# EAGLE design PMB (EAGLE 8.1.0)
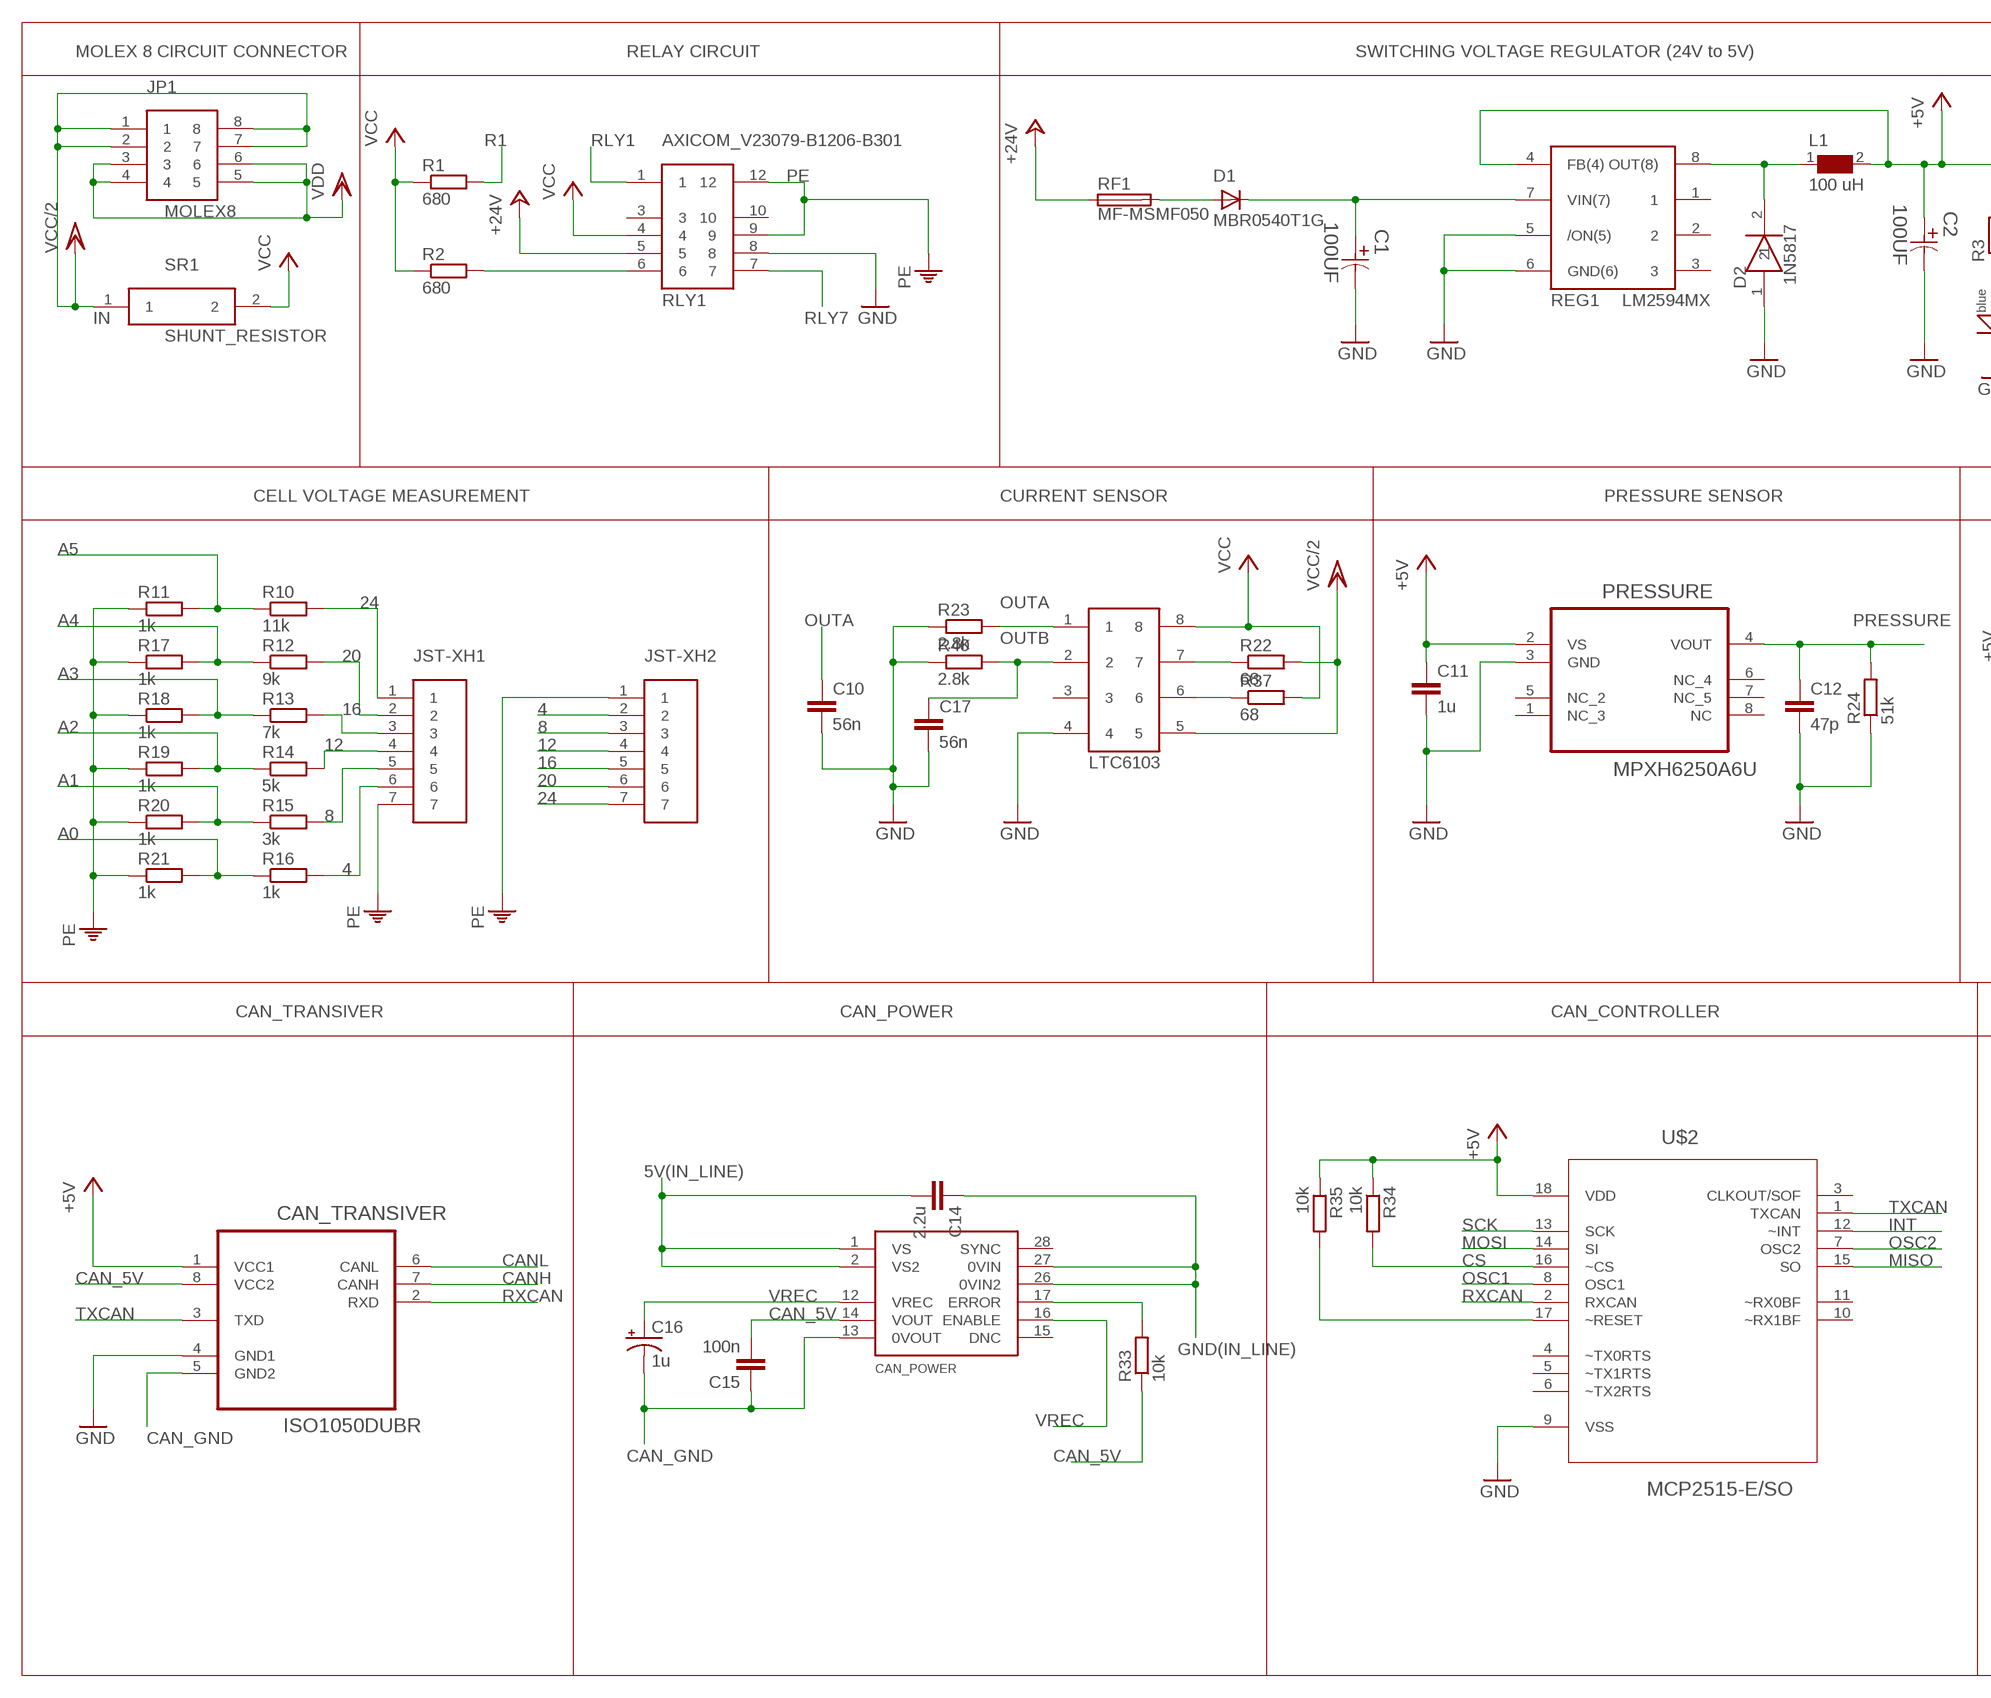
[diagram p0: schematic, sheet 1, part 1 of 2]
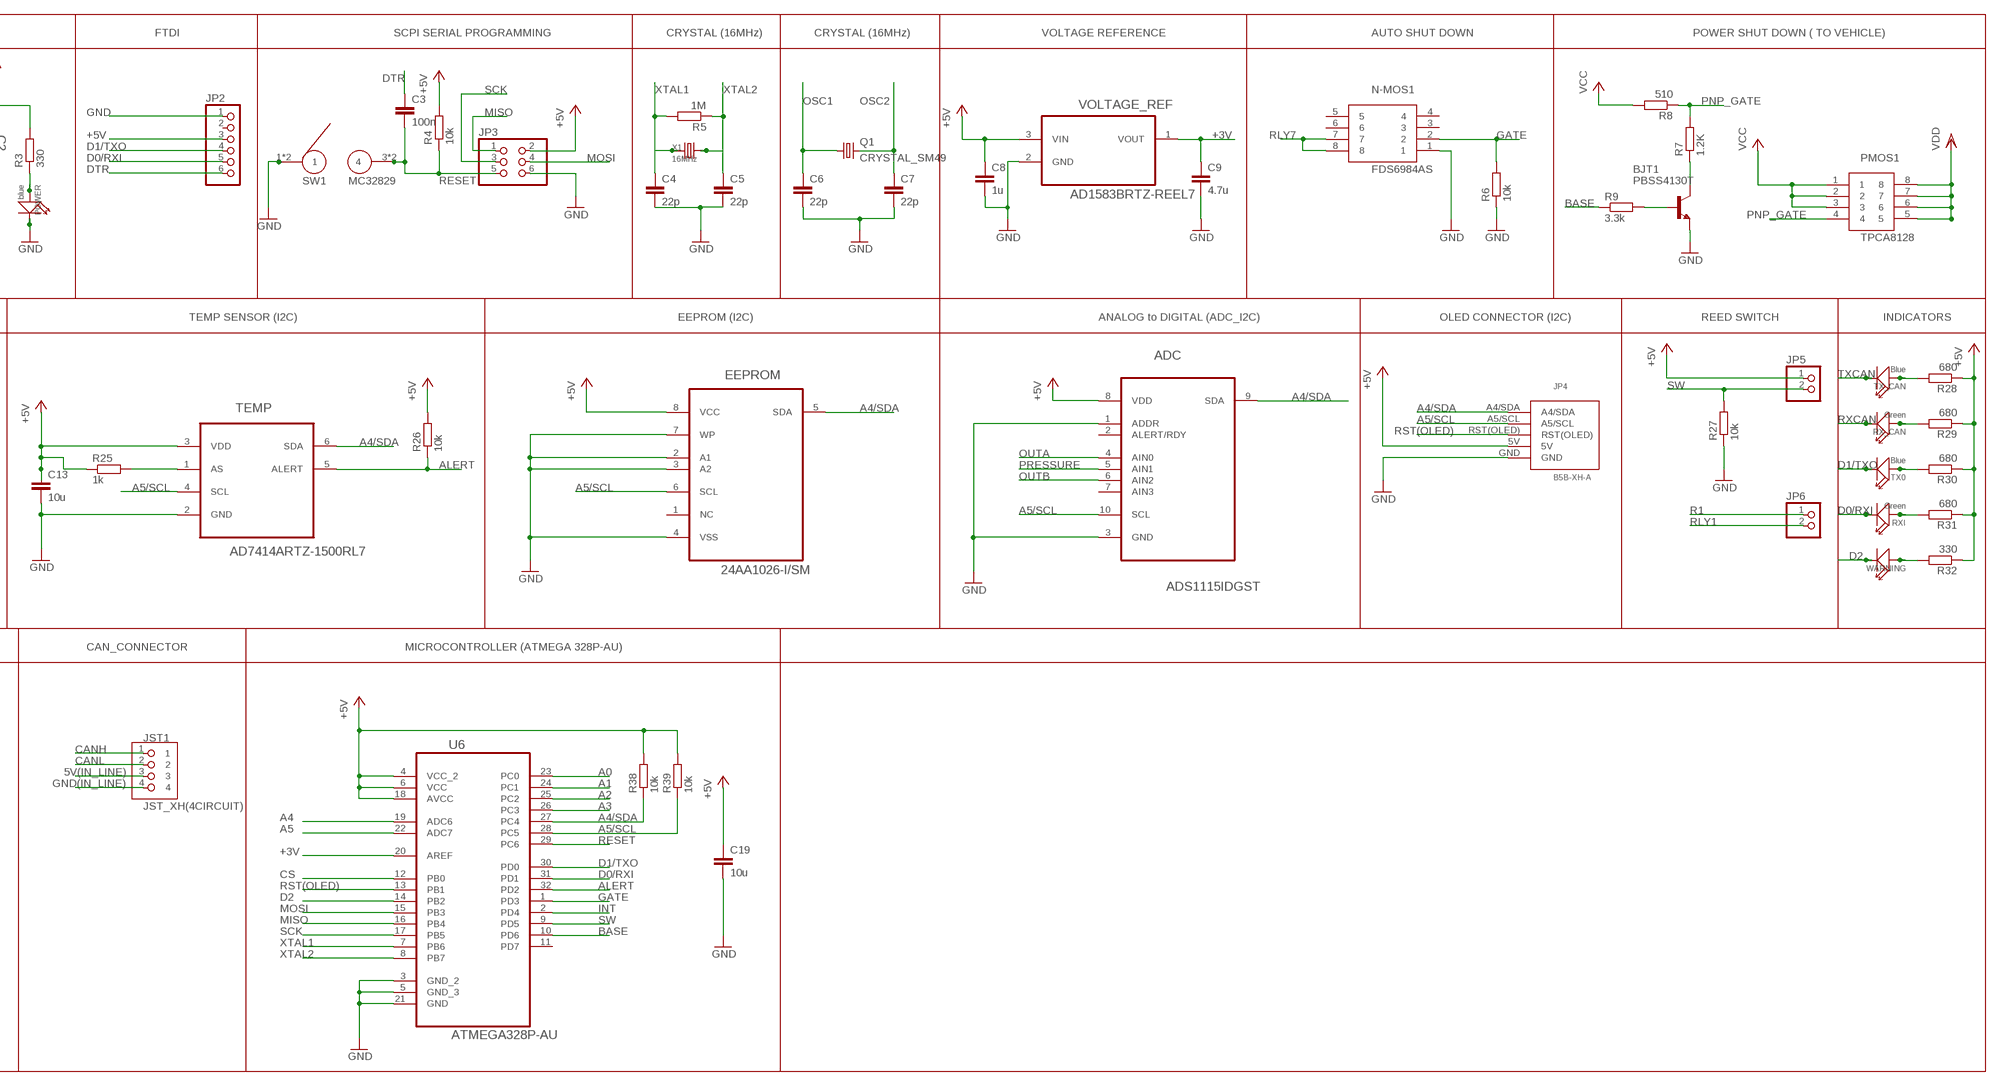
[diagram p1: schematic, sheet 1, part 2 of 2]

## Parts
ADC  ADS1115IDGST  [SOP50P490X110-10N]
BJT1  PBSS4130T  [SOT-23]
C1  100UF  EEE-FTV151XAP-CASE-D8  [CAPAE660X800N]
C2  100UF  EEE-FTV151XAP-CASE-D8  [CAPAE660X800N]
C3  100n  CAP0805  [0805]
C4  22p  CAP0805  [0805]
C5  22p  CAP0805  [0805]
C6  22p  CAP0805  [0805]
C7  22p  CAP0805  [0805]
C8  1u  CAP0805  [0805]
C9  4.7u  CAP0805  [0805]
C10  56n  CAP0805  [0805]
C11  1u  CAP0805  [0805]
C12  47p  CAP0805  [0805]
C13  10u  CAP0805  [0805]
C14  2.2u  CAP0603-CAP  [0603-CAP]
C15  100n  1UF-25V-10%(0805)  [0805]
C16  1u  CAP_POL6032  [EIA6032]
C17  56n  CAP0805  [0805]
C19  10u  CAP0805  [0805]
CAN_POWER  DCR01SO  [DCR01-SOIC28]
CAN_TRANSIVER  ISO1050DUBR  [SOIC254P1040X485-8N]
D1  MBR0540T1G  [MBR0540T1G]
D2  1N5817  [1N5817]
EEPROM  24AA1026-I/SM  [SOIC127P794X200-8N]
JP1  MOLEX8  [026013144]
JP2  PINHD-1X6/90  [1X06/90]
JP3  PINHD-2X3  [2X03]
JP4  B5B-XH-A  [B5B-XH-A]
JP5  PINHD-1X2/90  [1X02/90]
JP6  PINHD-1X2/90  [1X02/90]
JST1  JST_XH(4CIRCUIT)  [JXT-XHP-4]
JST-XH1  JST_XH_1X7_2.5MM  [SIL_1X8_2.5MM]
JST-XH2  JST_XH_1X7_2.5MM  [SIL_1X8_2.5MM]
L1  100 uH  WE-PD-7447714101_1030/1050  [WE-PD_1030/1050]
LTC1  LTC6103  [LTC6103]
N-MOS1  FDS6984AS  [SO-8]
PMOS1  TPCA8128  [TPCA8128]
POWER  blue  LED-0805  [LED-0805]
PRESSURE  MPXH6250A6U  [FREESCALE_CASE_1317]
Q1  CRYSTAL_SM49  [SM49]
R1  680  R-EU_R0805W  [R0805W]
R2  680  R-EU_R0805W  [R0805W]
R3  330  R-EU_R0805W  [R0805W]
R4  10k  R-EU_R0805W  [R0805W]
R5  1M  R-EU_R0805W  [R0805W]
R6  10k  R-EU_R0805W  [R0805W]
R7  1.2K  R-EU_R0805W  [R0805W]
R8  510  R-EU_R0805W  [R0805W]
R9  3.3k  R-EU_R0805W  [R0805W]
R10  11k  R-EU_R0805W  [R0805W]
R11  1k  R-EU_R0805W  [R0805W]
R12  9k  R-EU_R0805W  [R0805W]
R13  7k  R-EU_R0805W  [R0805W]
R14  5k  R-EU_R0805W  [R0805W]
R15  3k  R-EU_R0805W  [R0805W]
R16  1k  R-EU_R0805W  [R0805W]
R17  1k  R-EU_R0805W  [R0805W]
R18  1k  R-EU_R0805W  [R0805W]
R19  1k  R-EU_R0805W  [R0805W]
R20  1k  R-EU_R0805W  [R0805W]
R21  1k  R-EU_R0805W  [R0805W]
R22  68  R-EU_R0805W  [R0805W]
R23  2.8k  R-EU_R0805W  [R0805W]
R24  51k  R-EU_R0805W  [R0805W]
R25  1k  R-EU_R0805W  [R0805W]
R26  10k  R-EU_R0805W  [R0805W]
R27  10k  R-EU_R0805W  [R0805W]
R28  680  R-EU_R0805W  [R0805W]
R29  680  R-EU_R0805W  [R0805W]
R30  680  R-EU_R0805W  [R0805W]
R31  680  R-EU_R0805W  [R0805W]
R32  330  R-EU_R0805W  [R0805W]
R33  10k  R-EU_R0805W  [R0805W]
R34  10k  R-EU_R0805W  [R0805W]
R35  10k  R-EU_R0805W  [R0805W]
R37  68  R-EU_R0805W  [R0805W]
R38  10k  R-EU_R0805W  [R0805W]
R39  10k  R-EU_R0805W  [R0805W]
R40  2.8k  R-EU_R0805W  [R0805W]
REG1  LM2594MX  [LM2594MX]
RF1  MF-MSMF050  [MF-MSF050]
RLY1  AXICOM_V23079-B1206-B301  [RELAY_V23079_B1206]
RX_CAN  Green  LED-0805  [LED-0805]
RXI  Green  LED-0805  [LED-0805]
SR1  SHUNT_RESISTOR  [OARSXPR002FLF]
SW1  MC32829  [MC32829]
TEMP  AD7414ARTZ-1500RL7  [SOT95P280X145-6N]
TX0  Blue  LED-0805  [LED-0805]
TX_CAN  Blue  LED-0805  [LED-0805]
U6  ATMEGA328P-AU  [QFP80P900X900X120-32N]
U$2  MCP2515-E/SO  [SOIC127P1030X265-18N]
VOLTAGE_REF  AD1583BRTZ-REEL7  [SOT95P237X112-3N]
WARNING  LED-0805  [LED-0805]
X1  16MHz  CRYSTAL  [HC49US]

## Nets
4: JST-XH1.6 JST-XH2.2 R16.2
5V(IN_LINE): C14.2 CAN_POWER.1(VS) CAN_POWER.2(VS2) JST1.3
8: JST-XH1.5 JST-XH2.3 R15.2
12: JST-XH1.4 JST-XH2.4 R14.2
16: JST-XH1.3 JST-XH2.5 R13.2
20: JST-XH1.2 JST-XH2.6 R12.2
24: JST-XH1.1 JST-XH2.7 R10.2
+3V: C9.1 U6.20(AREF) VOLTAGE_REF.1(VOUT)
+5V: ADC.8(VDD) C2.1 C8.1 C11.1 C13.1 C19.1 CAN_TRANSIVER.1(VCC1) EEPROM.8(VCC) JP2.3 JP3.2 JP4.5V JP5.1 L1.2 PRESSURE.2(VS) R3.2 R4.2 R25.1 R26.2 R28.1 R29.1 R30.1 R31.1 R32.1 R34.1 R35.1 R38.2 R39.2 REG1.4(FB(4)) TEMP.3(VDD) U6.4(VCC_2) U6.6(VCC) U6.18(AVCC) U$2.18(VDD) VOLTAGE_REF.3(VIN)
+24V: RF1.1 RLY1.5
A0: R16.1 R21.2 U6.23(PC0)
A1: R15.1 R20.2 U6.24(PC1)
A2: R14.1 R19.2 U6.25(PC2)
A3: R13.1 R18.2 U6.26(PC3)
A4: R12.1 R17.2 U6.19(ADC6)
A4/SDA: ADC.9(SDA) EEPROM.5(SDA) JP4.A4/SDA R38.1 TEMP.6(SDA) U6.27(PC4)
A5: R10.1 R11.2 U6.22(ADC7)
A5/SCL: ADC.10(SCL) EEPROM.6(SCL) JP4.A5/SCL R39.1 TEMP.4(SCL) U6.28(PC5)
ALERT: R26.1 TEMP.5(ALERT) U6.32(PD2)
BASE: R9.1 U6.10(PD6)
CAN_5V: C15.2 CAN_POWER.14(VOUT) CAN_TRANSIVER.8(VCC2) R33.1
CAN_GND: C15.1 C16.P$2(-) CAN_POWER.13(0VOUT) CAN_TRANSIVER.5(GND2)
CANH: CAN_TRANSIVER.7(CANH) JST1.1
CANL: CAN_TRANSIVER.6(CANL) JST1.2
CS: R34.2 U6.12(PB0) U$2.16(~CS)
D0/RXI: JP2.5 RXI.- U6.31(PD1)
D1/TXO: JP2.4 TX0.- U6.30(PD0)
D2: U6.14(PB2) WARNING.-
DTR: C3.1 JP2.6
GATE: N-MOS1.2 R6.2 U6.1(PD3)
GND: ADC.1(ADDR) ADC.3(GND) BJT1.E C1.2 C2.2 C4.2 C5.2 C6.2 C7.2 C8.2 C9.2 C10.2 C11.2 C12.2 C13.2 C17.2 C19.2 CAN_TRANSIVER.4(GND1) D2.1 EEPROM.2(A1) EEPROM.3(A2) EEPROM.4(VSS) EEPROM.7(WP) JP2.1 JP3.6 JP4.GND LTC1.4 N-MOS1.1 POWER.- PRESSURE.3(GND) R6.1 R23.1 R24.1 R27.1 R40.1 REG1.5(/ON(5)) REG1.6(GND(6)) RLY1.8 SW1.1 SW1.2 TEMP.2(GND) U6.3(GND_2) U6.5(GND_3) U6.21(GND) U$2.9(VSS) VOLTAGE_REF.2(GND)
GND(IN_LINE): C14.1 CAN_POWER.26(0VIN2) CAN_POWER.27(0VIN) JST1.4
INT: U6.2(PD4) U$2.12(~INT)
MISO: JP3.1 U6.16(PB4) U$2.15(SO)
MOSI: JP3.4 U6.15(PB3) U$2.14(SI)
N$1: BJT1.B R9.2
N$2: D1.2 RF1.2
N$3: C1.1 D1.1 REG1.7(VIN(7))
N$4: R2.2 RLY1.6
N$5: D2.2 L1.1 REG1.8(OUT(8))
N$6: BJT1.C R7.1
N$7: POWER.+ R3.1
N$8: LTC1.7 R22.1
N$9: R25.2 TEMP.1(AS)
N$10: R32.2 WARNING.+
N$11: R31.2 RXI.+
N$12: R30.2 TX0.+
N$13: R29.2 RX_CAN.+
N$14: R28.2 TX_CAN.+
N$15: LTC1.6 R37.1
N$21: CAN_POWER.17(ERROR) R33.2
N$24: R35.2 U$2.17(~RESET)
OSC1: C6.1 Q1.1 U$2.8(OSC1)
OSC2: C7.1 Q1.2 U$2.7(OSC2)
OUTA: ADC.4(AIN0) C10.1 LTC1.1 R23.2
OUTB: ADC.6(AIN2) C17.1 LTC1.2 R40.2
PE: JST-XH1.7 JST-XH2.1 R11.1 R17.1 R18.1 R19.1 R20.1 R21.1 RLY1.9 RLY1.12
PNP_GATE: PMOS1.4 R7.2 R8.1
PRESSURE: ADC.5(AIN1) C12.1 PRESSURE.4(VOUT) R24.2
R1: JP6.1 R1.2
RESET: C3.2 JP3.5 R4.1 SW1.3 SW1.4 U6.29(PC6)
RLY1: JP6.2 RLY1.1
RLY7: N-MOS1.7 N-MOS1.8 RLY1.7
RST(OLED): JP4.RST(OLED) U6.13(PB1)
RXCAN: CAN_TRANSIVER.2(RXD) RX_CAN.- U$2.2(RXCAN)
SCK: JP3.3 U6.17(PB5) U$2.13(SCK)
SW: JP5.2 R27.2 U6.9(PD5)
TXCAN: CAN_TRANSIVER.3(TXD) TX_CAN.- U$2.1(TXCAN)
VCC: LTC1.8 PMOS1.1 PMOS1.2 PMOS1.3 R1.1 R2.1 R8.2 R37.2 RLY1.4 SR1.2
VCC/2: JP1.1 JP1.2 JP1.7 JP1.8 LTC1.5 R22.2 SR1.1
VDD: JP1.3 JP1.4 JP1.5 JP1.6 PMOS1.5 PMOS1.6 PMOS1.7 PMOS1.8
VREC: C16.P$1(+) CAN_POWER.12(VREC) CAN_POWER.16(ENABLE)
XTAL1: C4.1 R5.2 U6.7(PB6) X1.1
XTAL2: C5.1 R5.1 U6.8(PB7) X1.2
Unconnected: ADC.2(ALERT/RDY) ADC.7(AIN3) CAN_POWER.15(DNC) CAN_POWER.28(SYNC) EEPROM.1(NC) JP2.2 LTC1.3 N-MOS1.3 N-MOS1.4 N-MOS1.5 N-MOS1.6 PRESSURE.1(NC_3) PRESSURE.5(NC_2) PRESSURE.6(NC_4) PRESSURE.7(NC_5) PRESSURE.8(NC) REG1.1 REG1.2 REG1.3 RLY1.3 RLY1.10 U6.11(PD7) U$2.3(CLKOUT/SOF) U$2.4(~TX0RTS) U$2.5(~TX1RTS) U$2.6(~TX2RTS) U$2.10(~RX1BF) U$2.11(~RX0BF)

## Notes on the sheet
- MOLEX 8 CIRCUIT CONNECTOR | RELAY CIRCUIT | SWITCHING VOLTAGE REGULATOR (24V to 5V) | FTDI | SCPI SERIAL PROGRAMMING | CRYSTAL (16MHz) | CRYSTAL (16MHz) | VOLTAGE REFERENCE | AUTO SHUT DOWN | POWER SHUT DOWN ( TO VEHICLE)
- IN
- CELL VOLTAGE MEASUREMENT | CURRENT SENSOR | PRESSURE SENSOR | TEMP SENSOR (I2C) | EEPROM (I2C) | ANALOG to DIGITAL (ADC_I2C) | OLED CONNECTOR (I2C) | REED SWITCH | INDICATORS
- CAN_TRANSIVER | CAN_POWER | CAN_CONTROLLER | CAN_CONNECTOR | MICROCONTROLLER (ATMEGA 328P-AU)

## Library data of the parts
ADC = ADS1115:ADS1115IDGST: Analog-to-Digital Converter with Internal Reference; MPN: ADS1115IDGST; OC_FARNELL: 1762981; OC_NEWARK: 25R1241; PACKAGE: MSOP-10; SUPPLIER: Texas Instruments
BJT1 = NPN:PBSS4130T
C1 C2 = Panasonic-EEEFT_EEEH:EEE-: Aluminum Electrolytic Capacitors,Surface Mount Type; MPN: EEE-FTV151XAP; OC_FARNELL: 1868418; OC_NEWARK: 31T8173; PACKAGE: CASE-D8; SUPPLIER: PANASONIC; TOLERANCE: ±20 %; VALUE: 150UF; VOLTAGERATING: 35V
C3-C13 C17 C19 = SparkFun-Capacitors:CAP: Capacitor Standard 0603 ceramic capacitor, and 0.1" leaded capacitor.
C14 = SparkFun-Passives:CAP: Capacitor Standard 0603 ceramic capacitor, and 0.1" leaded capacitor.
C15 = SparkFun-Capacitors:1UF-25V-10%(0805): CAP-08064; PROD_ID: CAP-08064; VALUE: 1uF
C16 = SparkFun-Passives:CAP_POL: Capacitor Polarized These are standard SMD and PTH capacitors. Normally 10uF, 47uF, and 100uF in electrolytic and tantalum varieties. Always verify the external diameter of the through hole cap, it varies with capacity, voltage, and manufacturer. The EIA devices should be standard.
CAN_POWER = bbauv:DCR01: The DCR01 family is a series of high-efficiency, input-isolated, output-regulated DC/DC converters. In addition to 1W nominal, galvanically-isolated output power capability, this range of DC/DCs offer very low output noise, thermal protection, and high accuracy. The DCR01 family is implemented in standard molded IC packaging, giving standard JEDEC outlines suitable for high-volume assembly. The DCR01 is manufactured using the same technology as standard IC packages, thereby achieving very high reliability.
CAN_TRANSIVER = CAN-Controller-Library:ISO1050DUBR: ISOLATED CAN TRANSCEIVER; MPN: ISO1050DUBR; OC_FARNELL: 2118645; OC_NEWARK: 14R9899; PACKAGE: DIP-8; SUPPLIER: TEXAS INSTRUMENTS
D1 = Power_diode:MBR0540T1G
D2 = diode:1N5817
EEPROM = eeprom:24AA1026-I/SM: Serial EEPROM,SOIC-8; MPN: 24AA1026-I/SM; OC_FARNELL: 1971893; OC_NEWARK: 59T0229; PACKAGE: SOIC-8; SUPPLIER: MICROCHIP
JP1 = molex8:MOLEX8
JP2 = pinhead:PINHD-1X6: PIN HEADER
JP3 = pinhead:PINHD-2X3: PIN HEADER
JP4 = jst-xh(5circuit):B5B-XH-A
JP5 JP6 = pinhead:PINHD-1X2: PIN HEADER
JST1 = jst-xh(4circuit):JST_XH(4CIRCUIT)
JST-XH1 JST-XH2 = SIL_1X8_2.5MM:JST_XH_1X7_2.5MM
L1 = WE-PD:WE-PD: SMD-Shielded Power Inductors WE-PD - Magnetically shielded version which results in a low leakage field - High storage capacity - Low self-losses - Highest possible current loading for SMD-Inducors -- Switching regulators with low operating voltages (computer, laptop, mobile phones, pagers) -- Integrated DC/DC-converter -- Is recommended for the application with switching regulators from National Semiconductor, Linear Technology, Texas Instruments and Fairchild Semiconductor, ect. -- Graphic cards -- Plastic base: Because of the one piece construction these are more suitable for high vibration or shock applications; MPN: 7447714101; OC_FARNELL: 2082677; OC_NEWARK: 88T7105; PACKAGE: 1050; SUPPLIER: Wuerth Elektronik
LTC1 = LTC6103:LTC6103
N-MOS1 = dual_n-mosfet:FDS6984AS
PMOS1 = p-mosfet:TPCA8128
POWER RX_CAN RXI TX0 TX_CAN WARNING = Discrete:LED
PRESSURE = pressure_sensor:MPXH6250A6U: SENSOR, PRESSURE, 20-250KPA, CASE 1317; MPN: MPXH6250A6U; OC_FARNELL: 2238140; OC_NEWARK: 47W3656; PACKAGE: CASE 1317; SUPPLIER: FREESCALE SEMICONDUCTOR
Q1 = crystal(16Mhz):CRYSTAL_SM49
R1-R35 R37-R40 = resistor:R-EU_: RESISTOR, European symbol
REG1 = lm2594:LM2594MX
RF1 = Resetable_fuse:MF-MSMF050
RLY1 = AXICOM_V23079_B1206:AXICOM_V23079-B1206-B301
SR1 = oarsxpr002flf:SHUNT_RESISTOR
SW1 = mc32829(pb_sw):MC32829
TEMP = pressure_sensor(AD7414):AD7414ARTZ-1500RL7: ±0.5°C Accurate, 10-Bit Digital Temperature Sensors; MPN: AD7414ARTZ-1500RL7; OC_FARNELL: 1699530; OC_NEWARK: 12M8805; PACKAGE: SOT-23-6; SUPPLIER: Analog Devices
U6 = atmel-atmega328p-au:ATMEGA328P-AU: 8-bit Microcontroller with In-System Programmable Flash; MPN: ATMEGA328P-AU; OC_FARNELL: 1715486; OC_NEWARK: 14R4631; PACKAGE: TQFP-32; SUPPLIER: Atmel
U$2 = CAN-Controller-Library:MCP2515-E/SO: Stand-Alone CAN Controller; DESCRIPTION: IC CAN CONTROLLER; MPN: MCP2515-E/SO; OC_FARNELL: 1605565; OC_NEWARK: 29H7134; PACKAGE: SOIC-18; SUPPLIER: Microchip
VOLTAGE_REF = AD1583:AD1583BRTZ-REEL7: Series Mode Voltage References; MPN: AD1583BRTZ-Reel7; OC_FARNELL: 2074900; OC_NEWARK: 59K3394; PACKAGE: SOT23-3; SUPPLIER: Analog Devices
X1 = Discrete:CRYSTAL*

## Board
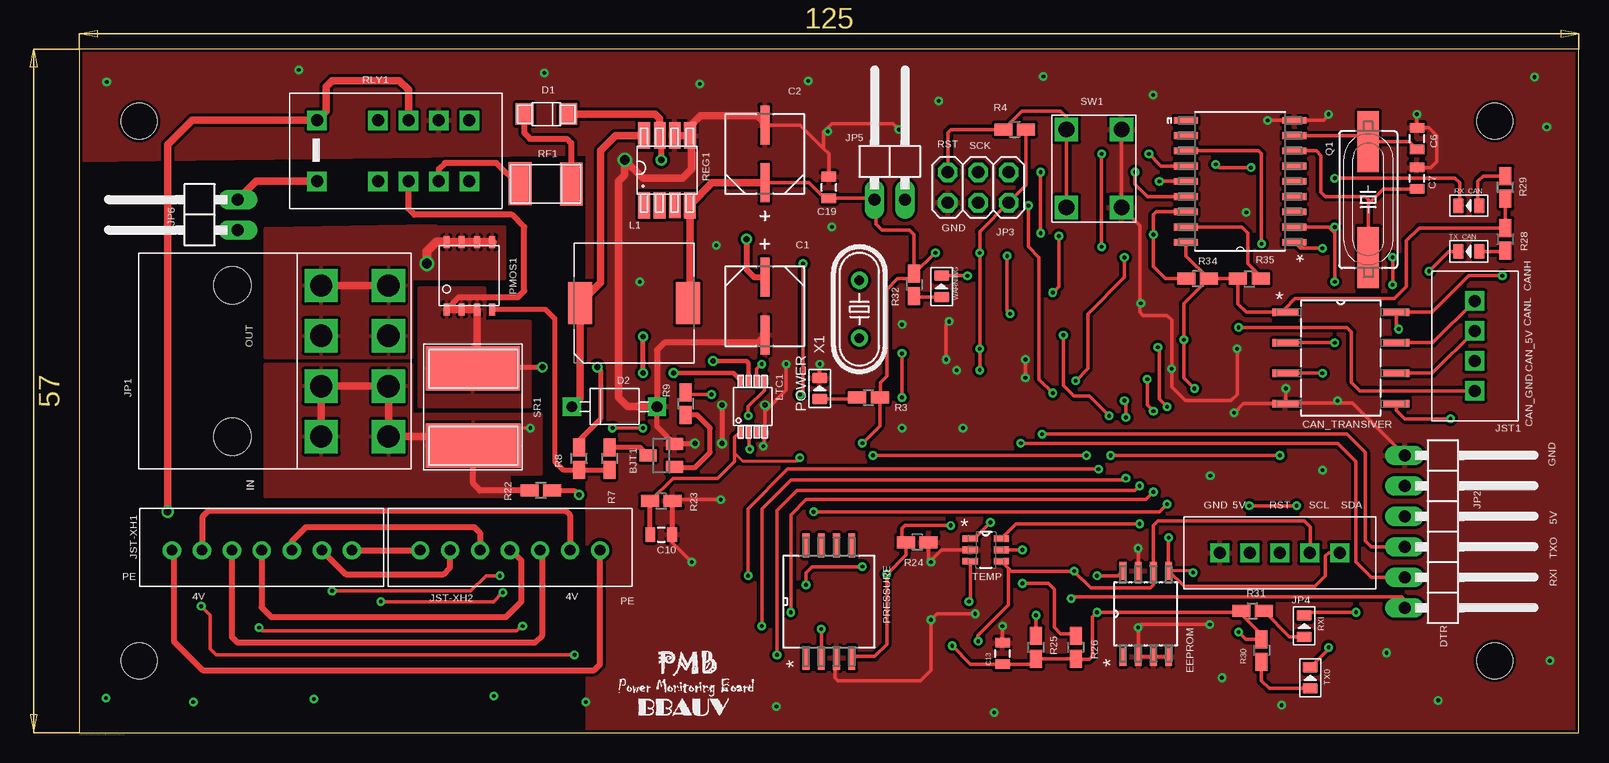
[diagram p2: board, top side]
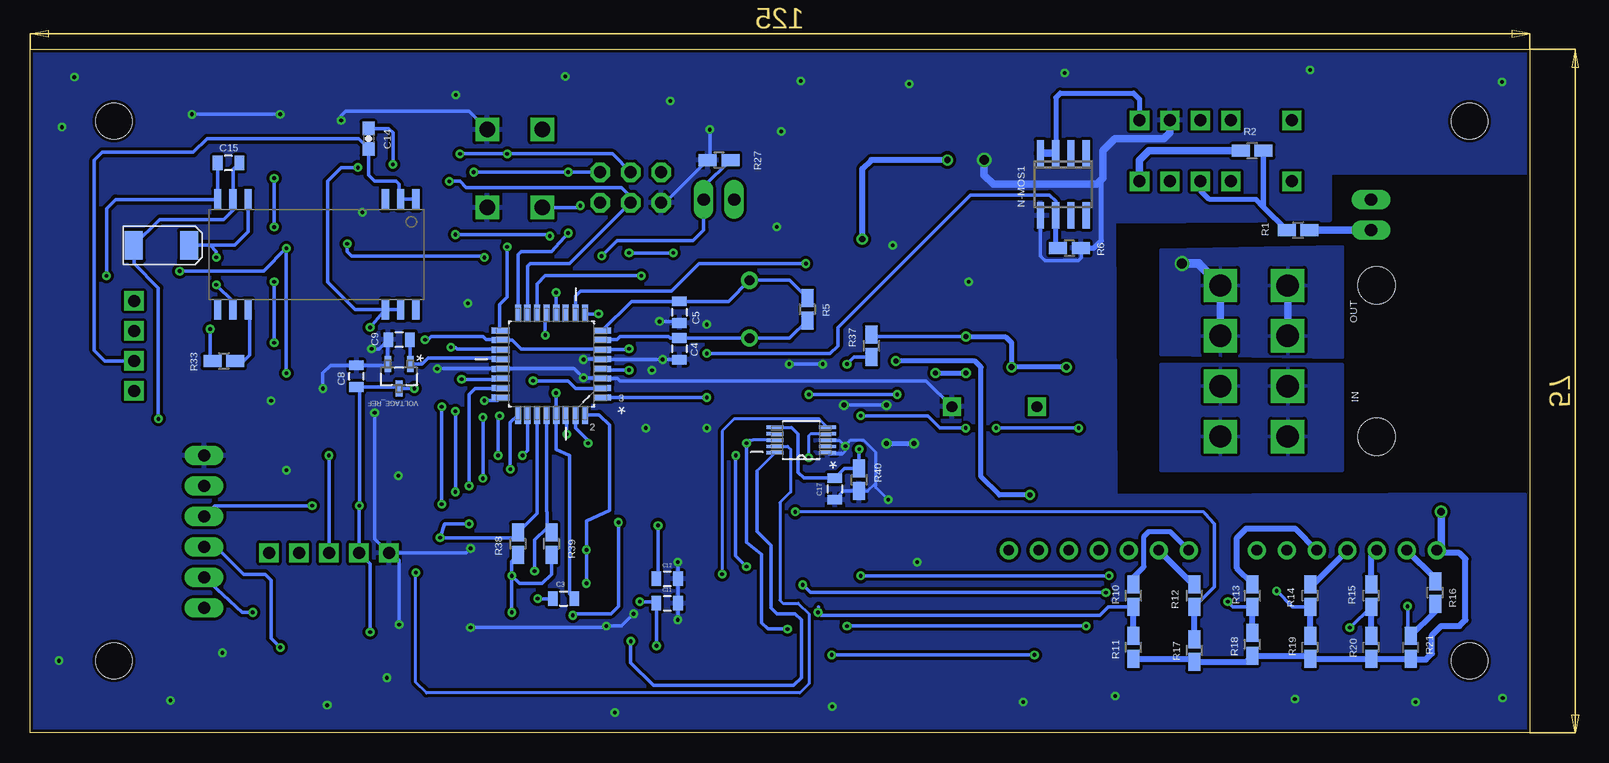
[diagram p3: board, bottom side, seen from below]

Size 125 x 57 mm. Coordinates in mm from the lower left corner, seen from the top.
Outline: 0,0 125,0 125,57 0,57 0,0
Copper layers (1*16): Top 0.035mm / dielectric 1.5mm / Bottom 0.035mm
Design rules "3ozKentronics *": minimum track width 10mil, minimum drill 12mil, track to track 10mil, track to pad 10mil, pad to pad 10mil, via to via 10mil, smd to smd 0mil, copper to edge 10mil, drill to drill 10mil, minimum pad ring 12mil, minimum via ring 8mil, stop-mask expansion 2mil, vias tented up to drill 25mil, thermal gap 10mil
Holes 3 mm at 118,6 118,51 5,6 5,51

### Footprints (pad centres in the part's own frame; a part is rotated, then mirrored left to right if it is on the bottom)
SOP50P490X110-10N = smd 1.422 x 0.279: 1 -2.184,1.054; 2 -2.184,0.521; 3 -2.184,-0.013; 4 -2.184,-0.546; 5 -2.184,-1.079; 6 2.184,-1.079; 7 2.184,-0.546; 8 2.184,-0.013; 9 2.184,0.521; 10 2.184,1.054
SOT-23 = smd 1 x 1.4: B -0.95,-1.1; C 0,1.1; E 0.95,-1.1
CAPAE660X800N = smd 3.251 x 0.762: 1 -2.413,0; 2 2.413,0
0805 = smd 0.8 x 1.2: 1 -0.9,0; 2 0.9,0
0603-CAP = smd 1.1 x 1: 1 -0.85,0; 2 0.85,0
EIA6032 = smd 1.5 x 2.4: P$1 -2.3,0; P$2 2.3,0
DCR01-SOIC28 = smd 0.6 x 1.7: 1 -8.255,-4.6; 2 -6.985,-4.6; 3 -5.715,-4.6; 12 5.715,-4.6; 13 6.985,-4.6; 14 8.255,-4.6; 15 8.255,4.6; 16 6.985,4.6; 17 5.715,4.6; 26 -5.715,4.6; 27 -6.985,4.6; 28 -8.255,4.6; P$2 -6.985,4.6
SOIC254P1040X485-8N = smd 2.159 x 0.61: 1 -4.623,3.81; 2 -4.623,1.27; 3 -4.623,-1.27; 4 -4.623,-3.81; 5 4.623,-3.81; 6 4.623,-1.27; 7 4.623,1.27; 8 4.623,3.81
MBR0540T1G = smd 1.5 x 1.8: 1 1.87,0.03; 2 -1.74,0.02
1N5817 = drill 0.9 square: 1 -3.2,0; 2 3.9,0
SOIC127P794X200-8N = smd 1.473 x 0.559: 1 -3.581,1.905; 2 -3.581,0.635; 3 -3.581,-0.635; 4 -3.581,-1.905; 5 3.581,-1.905; 6 3.581,-0.635; 7 3.581,0.635; 8 3.581,1.905
026013144 = drill 1.85 square: 1 -6.3,-2.8; 2 -2.1,-2.8; 3 2.1,-2.8; 4 6.3,-2.8; 5 6.3,2.8; 6 2.1,2.8; 7 -2.1,2.8; 8 -6.3,2.8 | hole 3.1: -6.3,10.2; 6.3,10.2
1X06/90 = drill 1.016 long: 1 -6.35,-3.81; 2 -3.81,-3.81; 3 -1.27,-3.81; 4 1.27,-3.81; 5 3.81,-3.81; 6 6.35,-3.81
2X03 = drill 1.016 octagon: 1 -2.54,-1.27; 2 -2.54,1.27; 3 0,-1.27; 4 0,1.27; 5 2.54,-1.27; 6 2.54,1.27
B5B-XH-A = drill 1 square: 5V 2.5,0; A4/SDA -5,0; A5/SCL -2.5,0; GND 5,0; RST(OLED) 0,0
1X02/90 = drill 1.016 long: 1 -1.27,-3.81; 2 1.27,-3.81
JXT-XHP-4 = drill 1 square: 1 -3.75,0; 2 -1.25,0; 3 1.25,0; 4 3.75,0
SIL_1X8_2.5MM = drill 0.9: 1 -7.5,0; 2 -5,0; 3 -2.5,0; 4 0.02,0; 5 2.5,0; 6 5,0; 7 7.5,0
WE-PD_1030/1050 = smd 2 x 3.5: 1 -4.5,0; 2 4.5,0
LTC6103 = smd 0.406 x 1.016: 1 -0.98,-2.169; 4 0.98,-2.169 | smd 0.381 x 1.016: 2 -0.32,-2.169; 3 0.32,-2.159; 5 0.97,2.19; 6 0.33,2.18 | smd 0.394 x 1.016: 7 -0.33,2.18; 8 -0.98,2.19
SO-8 = smd 0.6 x 2.2: 1 1.905,2.6; 2 0.635,2.6; 3 -0.635,2.6; 4 -1.905,2.6; 5 -1.905,-2.6; 6 -0.635,-2.6; 7 0.635,-2.6; 8 1.905,-2.6
TPCA8128 = smd 0.5 x 1: 1 -1.905,-2.8; 2 -0.635,-2.8; 3 0.635,-2.8; 4 1.905,-2.8; 5 1.905,2.8; 6 0.635,2.8; 7 -0.635,2.8; 8 -1.905,2.8
LED-0805 = smd 0.889 x 1.27: + -0.889,0; - 0.889,0
FREESCALE_CASE_1317 = smd 1.981 x 0.559: 1 -4.699,1.905; 2 -4.699,0.635; 3 -4.699,-0.635; 4 -4.699,-1.905; 5 4.699,-1.905; 6 4.699,-0.635; 7 4.699,0.635; 8 4.699,1.905
SM49 = smd 5.08 x 1.778: 1 -4.826,0; 2 4.826,0
R0805W = smd 1.5 x 1: 1 -0.94,0; 2 0.94,0
LM2594MX = smd 1 x 2.2: 1 -1.93,-3.01; 2 -0.65,-3.01; 5 1.89,2.81; 8 -1.93,2.8 | smd 0.978 x 2.2: 3 0.62,-3; 4 1.87,-3.01 | smd 0.978 x 2.184: 6 0.61,2.819; 7 -0.635,2.819
MF-MSF050 = smd 1.9 x 3.6: 1 -2.13,0.05; 2 2.15,0.03
RELAY_V23079_B1206 = drill 1 square: 1 -7.62,-2.54; 3 -2.54,-2.54; 4 0,-2.54; 5 2.54,-2.54; 6 5.08,-2.54; 7 5.08,2.54; 8 2.54,2.54; 9 0,2.54; 10 -2.54,2.54; 12 -7.62,2.54
OARSXPR002FLF = smd 3.7 x 7.9: 1 -3.26,0.19; 2 3.19,0.22
MC32829 = drill 1.3 square: 1 -3.3,2.3; 2 3.2,2.3; 3 -3.3,-2.3; 4 3.2,-2.3
SOT95P280X145-6N = smd 1.27 x 0.559: 1 -1.295,0.94; 2 -1.295,0; 3 -1.295,-0.94; 4 1.295,-0.94; 5 1.295,0; 6 1.295,0.94
QFP80P900X900X120-32N = smd 1.473 x 0.508: 1 -4.242,2.794; 2 -4.242,2.007; 3 -4.242,1.194; 4 -4.242,0.406; 5 -4.242,-0.406; 6 -4.242,-1.194; 7 -4.242,-2.007; 8 -4.242,-2.794; 17 4.242,-2.794; 18 4.242,-2.007; 19 4.242,-1.194; 20 4.242,-0.406; 21 4.242,0.406; 22 4.242,1.194; 23 4.242,2.007; 24 4.242,2.794 | smd 0.508 x 1.473: 9 -2.794,-4.242; 10 -2.007,-4.242; 11 -1.194,-4.242; 12 -0.406,-4.242; 13 0.406,-4.242; 14 1.194,-4.242; 15 2.007,-4.242; 16 2.794,-4.242; 25 2.794,4.242; 26 2.007,4.242; 27 1.194,4.242; 28 0.406,4.242; 29 -0.406,4.242; 30 -1.194,4.242; 31 -2.007,4.242; 32 -2.794,4.242
SOIC127P1030X265-18N = smd 1.981 x 0.559: 1 -4.521,5.08; 2 -4.521,3.81; 3 -4.521,2.54; 4 -4.521,1.27; 5 -4.521,0; 6 -4.521,-1.27; 7 -4.521,-2.54; 8 -4.521,-3.81; 9 -4.521,-5.08; 10 4.521,-5.08; 11 4.521,-3.81; 12 4.521,-2.54; 13 4.521,-1.27; 14 4.521,0; 15 4.521,1.27; 16 4.521,2.54; 17 4.521,3.81; 18 4.521,5.08
SOT95P237X112-3N = smd 1.321 x 0.559: 1 -1.016,0.94; 2 -1.016,-0.94; 3 1.016,0
HC49US = drill 0.813: 1 -2.413,0; 2 2.413,0

### Placement (x,y rotation side)
ADC  60.71,24.38 180 bottom
BJT1  48.51,23.11 90 top
C1  57.15,35.56 270 top
C2  57.15,48.26 90 top
C3  80.52,11.18 0 bottom
C4  70.87,32 270 bottom
C5  70.87,35.05 270 bottom
C6  111.51,49.53 90 top
C7  111.51,46.23 90 top
C8  97.79,29.72 90 bottom
C9  94.23,32.77 180 bottom
C10  48.51,16.51 0 top
C11  71.88,10.79 0 bottom
C12  71.88,12.83 0 bottom
C13  76.96,6.6 90 top
C14  96.77,49.53 270 bottom
C15  108.46,47.5 180 bottom
C16  114.05,40.64 180 bottom
C17  57.91,20.32 270 bottom
C19  62.48,45.47 90 top
CAN_POWER  101.09,39.88 180 bottom
CAN_TRANSIVER  105.16,31.24 0 top
D1  38.86,51.56 0 top
D2  44.96,27.18 180 top
EEPROM  88.9,9.91 90 top
JP1  22.97,30.99 90 top
JP2  114.3,16.76 270 top
JP3  74.93,45.47 180 top
JP4  100.08,14.99 180 top
JP5  67.56,48.26 0 top
JP6  9.4,43.18 90 top
JST1  116.33,32.26 270 top
JST-XH1  15.22,15.21 180 top
JST-XH2  35.91,15.21 180 top
L1  46.23,35.81 0 top
LTC1  56.13,27.18 0 top
N-MOS1  38.86,45.72 180 bottom
PMOS1  32.51,38.1 0 top
POWER  61.72,28.7 90 top
PRESSURE  62.48,10.92 90 top
Q1  107.44,44.45 270 top
R1  19.3,41.91 0 bottom
R2  23.11,48.51 180 bottom
R3  65.79,27.94 0 top
R4  77.98,50.29 0 top
R5  60.2,35.31 270 bottom
R6  38.35,40.39 180 bottom
R7  44.2,22.86 270 top
R8  41.66,22.86 90 top
R9  50.55,27.43 270 top
R10  33.02,11.43 90 bottom
R11  33.02,7.11 90 bottom
R12  27.94,11.43 90 bottom
R13  23.11,11.43 90 bottom
R14  18.29,11.43 90 bottom
R15  13.21,11.43 90 bottom
R16  7.87,11.68 90 bottom
R17  27.94,6.86 90 bottom
R18  23.11,7.37 90 bottom
R19  18.29,7.11 90 bottom
R20  13.21,7.11 90 bottom
R21  9.91,7.11 90 bottom
R22  38.48,20.19 180 top
R23  48.51,19.3 180 top
R24  69.85,15.88 180 top
R25  79.76,7.11 90 top
R26  83.06,7.11 270 top
R27  67.56,47.75 0 bottom
R28  118.87,41.15 270 top
R29  118.87,45.47 90 top
R30  98.55,6.86 270 top
R31  97.79,10.16 0 top
R32  69.6,37.34 270 top
R33  108.84,30.99 0 bottom
R34  93.22,37.85 180 top
R35  97.54,37.85 0 top
R37  54.86,32.26 90 bottom
R38  84.33,15.75 270 bottom
R39  81.53,15.75 270 bottom
R40  55.88,21.08 90 bottom
REG1  49.02,46.99 0 top
RF1  38.86,45.72 0 top
RLY1  27.43,48.51 0 top
RX_CAN  115.82,43.94 180 top
RXI  102.11,8.89 90 top
SR1  33.02,27.18 90 top
SW1  84.58,46.99 270 top
TEMP  75.56,15.24 0 top
TX0  102.62,4.57 90 top
TX_CAN  115.82,40.13 180 top
U6  81.53,30.73 180 bottom
U$2  96.77,45.97 180 top
VOLTAGE_REF  94.23,29.72 270 bottom
WARNING  71.88,37.21 90 top
X1  65.02,35.31 90 top

### Tracks (layer width: path | path; a pad name or v marks a point on that pad's centre or on a via)
4
  Top 0.508: JST-XH1.6 10.29,15.28 10.29,18.03 10.79,18.54 40.51,18.54 40.91,18.14 JST-XH2.2
  Bottom 0.457: R16.2 7.87,12.86
  Bottom 0.508: 7.87,12.86 JST-XH1.6
5V(IN_LINE)
  Bottom 0.305: CAN_POWER.1 CAN_POWER.2 94.23,44.6 94.23,45.72 94.49,45.97 96.27,45.97 96.77,46.48 C14.2 97.62,49.53 110.24,49.53 111.38,48.39 119,48.39 119.63,47.75 119.63,31.88 118.77,31.01 JST1.3
8
  Top 0.508: JST-XH1.5 12.72,7.98 13.21,7.49 37.97,7.49 38.61,8.13 38.61,15.01 JST-XH2.3
  Bottom 0.508: R15.2 13.21,14.72 JST-XH1.5
12
  Top 0.508: JST-XH1.4 15.2,10.45 16,9.65 35.56,9.65 36.83,10.92 36.83,14.35 35.97,15.21 JST-XH2.4
  Bottom 0.457: R14.2 18.04,12.37
  Bottom 0.508: 18.04,12.37 JST-XH1.4
16
  Top 0.508: JST-XH1.3 17.72,15.94 18.92,17.14 32.89,17.14 33.4,16.64 JST-XH2.5
  Bottom 0.457: R13.2 23.11,12.45
  Bottom 0.508: 23.11,12.45 24.38,13.72 24.38,16.26 23.62,17.02 19.53,17.02 JST-XH1.3
20
  Top 0.508: 30.99,15.13 JST-XH2.6 30.91,13.77 30.35,13.21 22.22,13.21 JST-XH1.2
  Bottom 0.508: R12.2 28.07,12.37 JST-XH2.6
24
  Top 0.508: JST-XH1.1 JST-XH2.7
  Bottom 0.406: 33.02,12.95 32.13,13.84 32.13,16.38 31.75,16.76 29.96,16.76 JST-XH2.7
  Bottom 0.508: R10.2 33.02,12.95
+3V
  Bottom 0.305: C9.1 93.29,32.73 VOLTAGE_REF.1 92.33,30.73 91.82,31.24 85.88,31.24 U6.20
+5V  (via drill 0.32)
  Top 0.305: R32.1 69.6,41.53 69.22,41.91 66.93,41.91 66.42,42.42 66.42,44.32 JP5.1 66.18,44.57 C19.1 62.11,44.57 60.83,45.85 C2.1 | R32.1 69.16,37.85 68.2,37.85 67.31,36.96 67.31,29.72 66.8,29.21 66.8,27.94 R3.2 66.73,25.58 v65.28,24.13 65.46,24.13 | R32.1 71.32,40.01 v71.37,40.01 | R4.2 78.92,45.64 JP3.2 75.06,41.78 v75.06,40.01 v75.06,32 v75.06,30.23 | R29.1 R28.1 111.68,42.09 110.62,41.02 110.62,37.21 109.6,36.2 101.35,36.2 100.53,35.38 CAN_TRANSIVER.1 97.28,35.05 96.6,35.74 R35.1 R34.1 | v92.96,28.7 92.08,29.59 v92.08,32.77 92.08,35.76 R34.1 | U$2.18 92.25,39.75 R34.1 | R31.1 96.72,10.03 | 96.72,10.03 v84.84,10.03 84.45,9.65 84.45,6.35 84.2,6.1 83.13,6.1 R26.2 R25.1 79.29,5.7 C13.1 74.31,5.7 v72.77,7.24 | v96.65,8.38 97.23,7.8 R30.1 98.55,8.2 96.72,10.03 | EEPROM.8 86.59,13.08 v84.84,13.08 | v101.47,18.92 v97.54,18.92 | v74.17,10.92 74.27,11.02 TEMP.3 | PRESSURE.2 v61.85,8.64
  Top 0.61: L1.2 50.13,36.41 50.89,37.17 REG1.4 52.76,45.85 C2.1
  Bottom 0.254: ADC.8 64.77,24.4 64.77,24.38 65.02,24.38 v65.28,24.13
  Bottom 0.305: v71.37,40.01 v75.06,40.01 | v75.06,32 75.13,31.93 U6.6 77.34,31.88 77.47,32 84.07,32 84.81,32.74 U6.18 85.8,32.77 87,32.77 87.25,33.02 91.57,33.02 91.82,32.77 v92.08,32.77 | U6.4 77.27,30.35 77.14,30.23 v75.06,30.23 | v92.96,28.7 VOLTAGE_REF.3 94.35,28.82 C8.1 97.54,28.56 v97.54,18.92 97.58,18.88 JP4.5V 96.65,14.06 v96.65,8.38 | v84.84,10.03 v84.84,13.08 | R38.2 84.84,14.3 v84.84,13.08 | R39.2 81.53,13.21 82.3,12.45 84.2,12.45 v84.84,13.08 | JP2.3 109.6,18.92 v101.47,18.92 | v74.17,10.92 72.91,10.92 C11.1 v72.77,7.24 | v61.85,8.64 63.5,8.64 64.01,9.14 64.01,14.86 65.28,15.88 v65.28,24.13
+24V
  Top 0.508: 36.99,44.55 RF1.1 36.48,45.77 34.75,47.5 30.48,47.5 29.97,46.99 RLY1.5
A0  (via drill 0.32)
  Top 0.305: v10.16,10.54 10.92,9.78 10.92,6.99 11.43,6.48 v41.27,6.48 | v88.39,20.57 88.01,20.19 59.82,20.19 58.17,18.54 v58.17,6.48
  Bottom 0.305: 10.03,8.18 10.16,8.31 v10.16,10.54 | v58.17,6.48 v41.27,6.48 | U6.23 85.8,28.7 87.88,28.7 88.39,28.19 v88.39,20.57
  Bottom 0.508: R16.1 7.87,10.08 R21.2 10.03,8.18
A1  (via drill 0.32)
  Top 0.305: v87.12,27.69 87.25,27.56 v87.25,26.29 | v87.25,21.21 87.12,21.08 59.31,21.08 56.9,18.67 v56.9,8.89 | v14.99,8.76 15.24,8.51 36.45,8.51 36.83,8.89 v36.96,8.89
  Bottom 0.305: U6.24 86.03,27.69 v87.12,27.69 | v87.25,26.29 v87.25,21.21 | R15.1 14.94,8.76 v14.99,8.76 | v36.96,8.89 v56.9,8.89
  Bottom 0.508: R20.2 R15.1
A2  (via drill 0.32)
  Top 0.305: v84.96,21.97 59.05,21.97 55.75,18.67 v55.75,13.08 | v21.08,11.81 32.64,11.81 33.91,13.08 v35.05,13.08
  Bottom 0.305: U6.25 84.96,25.86 v84.96,21.97 | R14.1 19.76,10.49 v21.08,11.81 | v35.05,13.08 v55.75,13.08
  Bottom 0.508: R19.2 R14.1
A3  (via drill 0.32)
  Top 0.305: v83.95,23.11 v66.17,23.11 | v65.28,13.84 61.09,13.84 60.58,13.34 v60.58,12.32 | v25.15,10.92 34.54,10.92 v35.31,11.68
  Bottom 0.305: U6.26 83.54,23.52 v83.95,23.11 | v66.17,23.11 66.17,14.73 v65.28,13.84 | R13.1 24.71,10.49 v25.15,10.92 | v35.31,11.68 59.94,11.68 v60.58,12.32
  Bottom 0.508: R18.2 R13.1
A4  (via drill 0.32)
  Top 0.305: v90.68,27.18 90.04,27.81 90.04,31.88 89.92,32 v89.92,32.13 | v90.68,19.05 90.04,18.41 v61.21,18.41
  Bottom 0.254: 27.05,18.29 27.18,18.41 v61.21,18.41
  Bottom 0.305: U6.19 85.85,32 89.41,32 89.53,32.13 v89.92,32.13 | v90.68,27.18 v90.68,19.05 | R12.1 26.29,12.14 26.29,17.4 27.05,18.29
  Bottom 0.508: R17.2 R12.1
A4/SDA  (via drill 0.3, 0.32)
  Top 0.254: v92.84,13.34 92.69,13.49 EEPROM.5
  Top 0.305: JP4.A4/SDA 104.14,14.99 103.89,14.73 103.89,13.08 103,12.19 92.1,12.19 EEPROM.5 v90.81,16.26 | TEMP.6 78.08,17.4 v88.39,17.4
  Bottom 0.254: ADC.9 61.86,23.86 61.85,23.88 61.59,23.62 61.59,20.07 62.48,19.18 62.48,11.05 62.23,10.79 60.96,10.79 60.07,9.91 60.07,4.06 60.83,3.3 91.95,3.3 92.84,4.19 v92.84,13.34
  Bottom 0.305: U6.27 82.73,18.29 R38.1 84.76,16.26 v90.81,16.26 90.42,17.4 v88.39,17.4
A5  (via drill 0.32)
  Top 0.305: v89.53,26.8 89.03,27.3 v89.03,29.46 | v89.53,20.07 88.9,19.43 60.58,19.43 59.31,18.16 v59.31,10.03
  Bottom 0.305: U6.22 85.83,29.59 85.95,29.46 v89.03,29.46 | v89.53,26.8 v89.53,20.07 | 59.26,10.49 v59.31,10.03 59.05,9.78 35.81,9.78 35.1,10.49 R10.1
  Bottom 0.508: R11.2 R10.1
A5/SCL  (via drill 0.3, 0.32)
  Top 0.305: JP4.A5/SCL 102.62,15.03 102.62,17.14 102.11,17.65 89.92,17.65 89.53,17.27 EEPROM.6 89.53,12.32 89.28,12.06 84.33,12.06 v82.93,13.46 77.7,13.46 77.47,13.69 | TEMP.4 77.47,13.69 | v74.93,7.62 74.93,8.13 77.47,10.67 77.47,13.69
  Bottom 0.254: ADC.10 64.39,21.83
  Bottom 0.305: U6.28 81.94,18.44 81.92,18.41 81.92,17.07 | 81.92,17.07 R39.1 | 81.92,17.07 82.93,16.05 v82.93,13.46 | v74.93,7.62 74.93,5.84 73.03,3.94 61.34,3.94 60.71,4.57 60.71,9.4 61.21,9.91 62.74,9.91 63.25,10.41 63.25,15.62 64.39,16.76 64.39,21.83
ALERT  (via drill 0.32)
  Top 0.305: TEMP.5 v78.61,15.24 | R26.1 82.86,8.26 81.79,8.26 81.28,8.76 81.28,11.94 80.77,12.45 v78.61,12.45
  Bottom 0.305: U6.32 77.55,26.49 76.71,25.65 76.71,18.54 78.61,17.65 v78.61,15.24 v78.61,12.45
BASE  (via drill 0.32)
  Top 0.305: R9.1 50.72,28.19 v52.7,28.19 | v60.07,28.19 60.33,28.45 v60.33,39.12
  Bottom 0.305: v52.7,28.19 v60.07,28.19 | v60.33,39.12 69.22,39.12 71.5,36.83 79.12,36.83 79.53,36.42 U6.10
CAN_5V  (via drill 0.3, 0.32)
  Top 0.305: v109.98,33.66 109.78,33.86 CAN_TRANSIVER.8 112.78,35.05 115.82,38.1 v118.62,38.1
  Bottom 0.305: R33.1 109.98,31.19 v109.98,33.66 | C15.2 109.35,47.49 CAN_POWER.14 109.38,44.45 117.86,44.45 118.62,43.69 v118.62,38.1
CAN_GND  (via drill 0.3)
  Top 0.305: CAN_TRANSIVER.5 109.78,26.87 110.49,26.16 v114.3,26.16
  Bottom 0.305: C15.1 108.08,46.98 CAN_POWER.13 108.08,43.56 108.84,42.8 114.19,42.8 C16.P$2 116.33,40.63 116.33,39.12 114.3,37.08 v114.3,26.16
CANH
  Top 0.305: CAN_TRANSIVER.7 112.84,32.51 JST1.1
CANL
  Top 0.305: CAN_TRANSIVER.6 112.8,29.97 JST1.2
CS  (via drill 0.32)
  Top 0.305: v81.15,36.7 81.66,37.21 v81.66,41.4 | U$2.16 89.79,43.43 89.53,43.18 v89.53,41.53 89.53,38.86 90.55,37.85 R34.2
  Bottom 0.305: U6.12 81.15,35 v81.15,36.7 | v81.66,41.4 81.79,41.53 v89.53,41.53
D0/RXI  (via drill 0.32)
  Top 0.305: v78.49,24.13 104.9,24.13 106.43,22.61 106.43,14.22 107.7,12.95 JP2.5 | RXI.- 102.36,10.03 v106.43,10.03
  Bottom 0.305: v106.43,10.03 107.31,10.03 JP2.5 | U6.31 79.5,26.49 79.5,25.4 78.49,24.38 v78.49,24.13
D1/TXO  (via drill 0.3)
  Top 0.305: v80.26,24.89 105.66,24.89 107.19,23.37 107.19,16 107.7,15.49 JP2.4 | TX0.- 104.14,6.99 v104.14,7.11
  Bottom 0.305: U6.30 80.26,26.42 v80.26,24.89 | v104.14,7.11 104.9,7.87 104.9,12.7 105.41,13.21 107.19,13.21 109.47,15.49 JP2.4
D2  (via drill 0.32)
  Top 0.305: WARNING.- v74.04,38.1
  Bottom 0.305: v74.04,38.1 82.04,38.1 82.73,37.41 U6.14
DTR  (via drill 0.32)
  Top 0.305: v82.68,11.18 82.8,11.3 110.24,11.3 110.49,11.05 JP2.6
  Bottom 0.305: C3.1 v82.68,11.18
GATE  (via drill 0.32)
  Top 0.305: v68.58,31.62 v68.58,27.94
  Bottom 0.305: v68.58,27.94 U6.1 | v68.58,31.62 58.29,31.62 57.66,32.26 57.66,33.78 46.61,44.83 40.01,44.83 39.5,44.32 N-MOS1.2
  Bottom 0.406: R6.2 39.5,40.59 N-MOS1.2
GND  (via drill 0.3, 0.32, 0.42, 0.8)
  Top 0.254: v57.02,23.88 57.11,23.97 LTC1.4
  Top 0.305: 62.04,48.7 62.48,48.26 C19.2 | v68.33,50.29 67.82,50.8 62.74,50.8 62.04,50.1 62.04,48.7 | SW1.1 SW1.2 88.39,42.28 88.39,35.05 88.65,34.8 90.68,34.8 91.06,34.42 v91.06,30.35 91.06,28.83 92.2,27.69 96.01,27.69 96.52,28.19 v96.52,32 | v99.06,51.05 U$2.9 103.76,51.05 v104.14,51.56 | v78.87,29.59 v78.87,31.11 | v96.27,26.67 97.03,27.43 CAN_TRANSIVER.4 100.58,27.48 | C7.2 112.66,47.13 113.16,47.62 113.16,49.78 112.51,50.43 C6.2 v111.51,51.56 | v100.58,28.7 100.58,27.48 | EEPROM.7 v88.27,15.37 | EEPROM.4 EEPROM.3 EEPROM.2 v88.27,8.76 88.52,9.02 v94.23,9.02 | C13.2 v76.96,8.89 | R24.1 70.79,14.43 v70.99,14.22 70.99,14.35 71.88,15.24 TEMP.2 | v74.68,9.91 71.5,9.91 v70.99,9.4 70.99,5.21 70.1,4.32 63.25,4.32 62.99,4.57 62.99,6.1 PRESSURE.3 | v72.52,34.29 72.26,34.04 v72.26,31.11 | 100.58,27.48 106.12,27.48 JP2.1 | 57.15,26.8 57.15,25.05 LTC1.4 57.15,24.97 | 57.15,26.8 v57.15,27.3 | R23.1 49.58,19.43 v53.47,19.43 | C10.2 49.41,15.86 v51.05,14.22 | POWER.- v61.72,30.73 | v58.93,30.73 58.93,28.57 57.15,26.8 | 62.04,48.7 60.07,50.67 C2.2
  Top 0.406: D2.1 48.16,25.52 BJT1.E 51.24,24.06 v51.31,24.13 | C10.2 49.45,16.55 R23.1 | v53.59,27.3 v53.59,24.13
  Top 0.508: C1.2 56.52,32.51 48.77,32.51 48.16,31.9 D2.1
  Top 0.61: D2.1 45.72,27.18 44.96,27.94 44.96,45.97 45.47,46.48 v45.47,47.75 46.99,46.23 50.29,46.23 51.05,46.99 51.05,49.66 REG1.5 | REG1.6 49.64,49.8 REG1.5 | REG1.5 50.91,50.56 51.78,51.44 56.52,51.44 57.15,50.8 C2.2
  Bottom 0.254: ADC.3 57.78,24.38 57.53,24.38 v57.02,23.88 | v57.02,23.88 57.02,23.5 57.28,23.24 58.43,23.24 ADC.1 57.37,23.33 | v53.47,19.43 54.48,20.45 54.48,20.83 | 54.48,20.83 54.48,23.37 55.5,24.38 56.64,24.38 v57.02,23.88 | R40.1 55.17,20.14 54.48,20.83
  Bottom 0.305: D2.1 50.32,29.34 75.82,29.34 76.02,29.54 U6.3 77.34,29.59 v78.87,29.59 79.63,30.35 85.75,30.35 U6.21 85.8,30.35 v91.06,30.35 | C5.2 71,34.29 v72.52,34.29 | v68.33,50.29 68.33,47.93 R27.1 72.06,44.2 JP3.6 | SW1.1 88.41,51.82 98.68,51.82 99.06,51.44 v99.06,51.05 | v78.87,31.11 78.84,31.14 U6.5 77.19,31.24 77.06,31.11 v72.26,31.11 70.88,31.11 C4.2 | JP4.GND 96.27,16.18 v96.27,26.67 | v111.51,51.56 v104.14,51.56 | v100.58,28.7 100.58,29.97 99.94,30.62 C8.2 95.29,30.62 VOLTAGE_REF.2 95.17,32.73 C9.2 95.9,32 v96.52,32 | v88.27,15.37 88.65,14.99 JP4.GND | v88.27,8.76 77.09,8.76 v76.96,8.89 75.69,8.89 v74.68,9.91 | v94.23,9.02 94.23,14.35 94.87,14.99 JP4.GND | v70.99,14.22 70.99,12.84 C12.2 C11.2 70.99,10.78 v70.99,9.4 | v57.15,27.3 v53.59,27.3 | C17.2 57.19,20.14 R40.1 | v61.72,30.73 v58.93,30.73 | R6.1 37.34,40.31 37.34,39.62 37.59,39.37 40.39,39.37 40.77,39.75 N-MOS1.1
  Bottom 0.406: v53.59,24.13 v51.31,24.13 | R6.1 36.32,40.39 35.69,41.02 35.69,46.1
  Bottom 0.61: RLY1.8 29.97,50.04 30.48,49.53 34.54,49.53 35.56,48.51 35.56,46.23 35.69,46.1 36.07,45.72 44.7,45.72 45.47,46.48 v45.47,47.75
  other vias: 68.58,25.4 73.15,30.23 73.66,25.4 46.74,37.59 53.09,40.64 62.74,42.16 104.9,27.69 68.58,34.04 42.21,2.54 34.54,3.05 19.56,2.79 9.5,2.54 2.24,2.9 58.12,2.18 76.25,1.68 95.25,4.57 100.23,2.29 108.97,6.65 113.28,2.69 122.58,5.99 88.49,35.81 94.28,21.44 103.63,21.89 122.33,50.5 121.31,54.66 89.51,53.19 97.28,43.38 80.37,54.71 71.63,52.68 60.76,54.36 62.38,50.14 51.71,54.1 38.76,55.02 2.29,54.25 18.29,55.27
  pour Top: 0.13,57.02 125.22,57.02 125.22,0 42.42,0.25 42.42,48.26 -0.13,47.75
  pour Bottom: 0,57.02 124.97,57.02 124.97,0 0.25,0 0.38,19.81 34.51,19.68 34.64,42.67 16.64,42.8 16.64,46.74 0,46.74
GND(IN_LINE)  (via drill 0.3)
  Top 0.305: JST1.4 106.75,28.51 106.05,29.21 106.05,33.4 105.66,33.78 v96.65,33.78 | v97.66,47.12 95,47.12 v94.74,47.37
  Bottom 0.305: v96.65,33.78 CAN_POWER.26 | CAN_POWER.26 97.89,35.28 100.2,37.59 100.2,45.97 99.06,47.12 v97.66,47.12 | v94.74,47.37 94.74,50.04 95.08,50.38 C14.1 | CAN_POWER.26 CAN_POWER.27
INT  (via drill 0.32)
  Top 0.305: v83.06,29.34 84.07,30.35 84.07,34.92 87.12,37.97 v87.12,39.62 | U$2.12 98.3,48.51 98.55,48.26 v98.55,40.77
  Bottom 0.305: v83.06,29.34 80.14,29.34 79.5,28.7 77.32,28.7 U6.2 | v87.12,39.62 87.25,39.75 98.17,39.75 98.55,40.13 v98.55,40.77
MISO  (via drill 0.32)
  Top 0.305: v80.14,46.74 v80.14,41.66 | U$2.15 89.03,44.7 88.01,45.72 v88.01,46.74
  Bottom 0.305: JP3.1 v80.14,46.74 v88.01,46.74 | v80.14,41.66 81.53,40.13 84.07,40.13 84.33,39.88 U6.16
MOSI  (via drill 0.32)
  Top 0.305: U$2.14 v90.04,45.97
  Bottom 0.305: U6.15 83.54,38.89 83.31,39.12 80.01,39.12 JP3.4 74.93,44.7 75.69,45.47 88.65,45.47 89.15,45.97 v90.04,45.97
N$1
  Top 0.406: BJT1.B 49.68,22.1 51.31,22.1 52.58,23.37 52.58,25.4 51.49,26.49 R9.2 50.55,25.91
N$2
  Top 0.508: D1.2 37.08,50.02 37.57,49.53 40.64,49.53 41.01,49.16 RF1.2
N$3  (via drill 0.52)
  Top 0.508: REG1.7 48.51,49.66 v48.51,47.75 | v55.63,41.15 55.63,38.61 56.26,37.97 C1.1
  Top 0.61: REG1.7 48.38,51.19 48.01,51.56 40.76,51.56 D1.1
  Bottom 0.508: v48.51,47.75 54.86,47.75 55.63,46.99 v55.63,41.15
N$4
  Bottom 0.61: R2.2 31.75,48.51 32.51,47.75 RLY1.6
N$5
  Top 0.61: D2.2 41.73,27.85 L1.1 43.43,37.52 43.43,48.51 44.71,49.79 REG1.8
N$6
  Top 0.406: BJT1.C 46.73,23.8 R7.1
N$7
  Top 0.305: POWER.+ 64.72,27.81 R3.1
N$8  (via drill 0.42)
  Top 0.356: v52.83,30.99 55.63,30.99 55.8,30.81 LTC1.7
  Top 0.406: R22.1 41.27,20.19 v41.66,19.81
  Bottom 0.406: v52.83,30.99 46.23,30.99 45.72,30.48 45.72,21.34 44.2,19.81 v41.66,19.81
N$9  (via drill 0.32)
  Top 0.305: R25.2 v79.76,9.78 | v75.95,17.53 74.6,16.18 TEMP.1
  Bottom 0.305: v79.76,9.78 79.63,9.91 76.58,9.91 75.95,10.54 v75.95,17.53
N$10
  Top 0.305: 69.79,36.59 R32.2 69.6,36.32 WARNING.+
N$11
  Top 0.305: R31.2 100.89,8 RXI.+
N$12
  Top 0.305: 98.87,5.6 R30.2 98.55,4.32 99.19,3.68 TX0.+
N$13
  Top 0.305: R29.2 117.02,46.41 116.59,45.97 116.59,44.07 RX_CAN.+
N$14
  Top 0.305: 118.54,39.88 R28.2 118.8,40.13 TX_CAN.+
N$15  (via drill 0.3)
  Top 0.305: LTC1.6 56.46,30.3 v56.9,30.73
  Bottom 0.305: v56.9,30.73 56.31,31.32 R37.1
N$21
  Bottom 0.305: CAN_POWER.17 106.68,35.15 106.68,31.5 107.19,30.99 R33.2
N$24
  Top 0.305: U$2.17 96.9,42.16 97.41,41.66 97.41,39.12 98.48,38.05 R35.2
OSC1
  Top 0.305: U$2.8 107.44,49.78 Q1.1 110.86,49.28 C6.1
OSC2
  Top 0.305: Q1.2 107.44,44.07 | 107.44,44.07 107.44,44.45 107.19,44.7 103.89,44.7 103.5,45.09 103.5,48.13 103.12,48.51 U$2.7 | C7.1 108.7,45.33 107.44,44.07
OUTA  (via drill 0.3)
  Top 0.254: 54.61,23.32 54.63,23.32 55.32,22.63 59.77,22.63 v60.07,22.94
  Top 0.305: R23.2 49.48,21.21 53.21,21.21 54.61,22.61 54.61,23.32 54.61,24.64 54.98,25.01 LTC1.1
  Top 0.406: C10.1 47.57,16.55 R23.2
  Bottom 0.254: ADC.4 58.53,24.92 59.92,24.92 60.07,24.77 v60.07,22.94
OUTB  (via drill 0.3)
  Top 0.305: LTC1.2 55.81,23.69 v55.88,23.62
  Bottom 0.254: ADC.6 61.53,25.46 61.47,25.4
  Bottom 0.305: v55.88,23.62 R40.2 57.11,22.02 C17.1 60.46,21.22 60.96,21.72 60.96,24.89 61.47,25.4
PE  (via drill 0.62)
  Top 0.457: JST-XH2.1
  Top 0.508: JST-XH2.1 43.4,5.68 42.93,5.21 10.29,5.21 7.87,7.62 7.87,15.06 JST-XH1.7
  Top 0.61: v7.37,18.41 7.37,49.02 9.4,51.05 RLY1.12 20.57,51.82 20.57,53.85 21.08,54.36 26.67,54.36 27.43,53.59 RLY1.9
  Bottom 0.508: R11.1 28.19,6.17 R17.1 23.62,5.92 R18.1 18.54,6.43 R19.1 R20.1 R21.1 9.83,6.1 8.64,6.1 8.13,6.6 8.13,8.13 7.37,8.89 5.84,8.89 5.33,9.4 5.33,14.48 5.84,14.99 7.5,14.99 JST-XH1.7
  Bottom 0.61: v7.37,18.41 7.37,15.56 JST-XH1.7
PNP_GATE
  Top 0.406: R7.2 R8.1 40.31,21.92 39.62,22.61 39.62,34.54 38.87,35.3 PMOS1.4
PRESSURE  (via drill 0.3, 0.32)
  Top 0.305: 72.52,17.4 v72.64,17.27 68.83,17.27 68.58,17.02 68.58,16.2 R24.2 68.91,14.81 v67.31,13.21 67.31,7.37 66.29,6.35 64.52,6.35 PRESSURE.4
  Bottom 0.254: ADC.5 59.22,26.16 66.29,26.16 67.31,25.15 v67.31,13.21
  Bottom 0.305: C12.1 72.64,12.96 v72.64,17.27
R1
  Bottom 0.61: R1.2 JP6.1
RESET  (via drill 0.32)
  Top 0.305: JP3.5 72.39,50.04 72.64,50.29 R4.1 78.56,51.82 81.79,51.82 82.28,51.32 SW1.3 SW1.4 | v81.15,28.32 80.01,29.46 80.01,39.62 79.12,40.51 v79.12,43.94
  Bottom 0.305: v81.15,28.32 81.15,26.52 U6.29 81.15,23.62 80.01,23.11 80.01,11.57 C3.2 | v79.12,43.94 79.27,43.79 SW1.4
RLY1
  Top 0.61: JP6.2 14.73,45.97 RLY1.1
RLY7
  Bottom 0.406: RLY1.7 32.51,52.83 33.02,53.34 39.12,53.34 39.5,52.96 N-MOS1.7
  Bottom 0.61: N-MOS1.8 N-MOS1.7
RST(OLED)  (via drill 0.32)
  Top 0.305: v82.04,33.15 82.04,28.96 82.93,28.07 84.2,28.07 v85.85,26.42 | v85.98,23.11 v100.08,23.11
  Bottom 0.305: U6.13 82.04,34.87 v82.04,33.15 | v85.85,26.42 85.98,26.29 v85.98,23.11 | v100.08,23.11 JP4.RST(OLED)
RXCAN  (via drill 0.32)
  Top 0.305: v104.65,46.23 114.68,46.23 115.06,45.85 115.06,44.07 RX_CAN.- | CAN_TRANSIVER.2 v104.65,32.51 | v104.65,37.59 104.65,41.66 | 104.65,41.66 v104.65,42.16 | U$2.2 104.14,42.16 104.65,41.66
  Bottom 0.305: v104.65,42.16 v104.65,46.23 | v104.65,32.51 v104.65,37.59
SCK  (via drill 0.32)
  Top 0.305: v89.15,48.26 90.17,47.24 U$2.13 | v85.22,40.51 v85.22,48.26
  Bottom 0.305: JP3.3 76.45,48.26 v85.22,48.26 v89.15,48.26 | U6.17 85.85,33.6 85.85,35.69 85.22,36.32 v85.22,40.51
SW  (via drill 0.32)
  Top 0.305: v77.6,34.92 77.34,35.18 v77.34,39.75
  Bottom 0.305: R27.2 68.83,45.54 JP5.2 68.83,41.91 69.72,41.02 76.07,41.02 v77.34,39.75 | U6.9 78.69,34.92 v77.6,34.92
TXCAN  (via drill 0.32)
  Top 0.305: U$2.1 101.8,40.39 v103.63,40.39 | CAN_TRANSIVER.3 v103.63,29.97 | TX_CAN.- 114.17,40.13 v112.52,38.48
  Bottom 0.305: v112.52,38.48 105.54,38.48 v103.63,40.39 v103.63,29.97
VCC  (via drill 0.42, 0.48)
  Top 0.356: v49.53,29.97 54.55,29.97 LTC1.8
  Top 0.406: 33.15,30.71 33.38,30.48 v38.61,30.48 | v43.18,30.48 43.43,30.23 43.43,26.16 41.66,24.38 R8.2 | v46.99,29.97 v46.99,33.02
  Top 0.508: PMOS1.1 31.63,36.32 36.58,36.32 37.08,36.83 37.08,42.16 36.07,43.18 27.94,43.18 27.43,43.69 RLY1.4
  Top 0.61: SR1.2 33.15,30.71 PMOS1.3 PMOS1.2 PMOS1.1
  Bottom 0.305: R37.2 54.69,33.02 v46.99,33.02
  Bottom 0.406: v38.61,30.48 v43.18,30.48 43.18,32.51 43.69,33.02 v46.99,33.02 | v49.53,29.97 v46.99,29.97 | 22.17,43.84 22.78,44.45 26.67,44.45 27.43,45.21 RLY1.4
  Bottom 0.457: R2.1 22.17,43.84 R1.1
  pour Top: 28.35,37.08 33.78,37.08 33.78,34.29 37.59,34.29 37.59,27.18 28.35,27.18
VCC/2  (via drill 0.3)
  Top 0.305: LTC1.5 57.1,28.53 55.75,27.18 v55.75,26.42 | v46.99,25.4 v44.45,25.4 | v37.59,25.4 34.31,25.4 SR1.1
  Top 0.508: SR1.1 32.83,20.76 33.4,20.19 R22.2
  Top 0.61: SR1.1 32.06,24.69 JP1.1 JP1.2 JP1.7 JP1.8
  Bottom 0.305: v55.75,26.42 50.16,26.42 49.15,25.4 v46.99,25.4 | v44.45,25.4 v37.59,25.4
  pour Top: 15.49,30.71 27.69,30.71 27.69,26.54 38.48,26.54 38.48,21.59 35.81,21.59 35.81,19.68 15.49,19.68
  pour Bottom: 15.62,30.71 30.73,30.71 30.73,21.84 15.62,21.84
VDD  (via drill 0.81)
  Top 0.61: JP1.5 JP1.4
  Top 0.762: v28.97,39.12 28.96,39.13 28.96,40.13 29.72,40.9 PMOS1.8 PMOS1.5
  Bottom 0.61: JP1.5 JP1.6 | JP1.4 JP1.3
  Bottom 0.762: JP1.4 27.6,39.12 v28.97,39.12
  pour Top: 15.49,42.04 29.72,42.29 29.72,42.16 35.43,42.16 35.43,37.85 27.69,37.85 27.69,31.27 15.49,31.27
  pour Bottom: 15.62,31.27 30.73,31.52 30.73,40.26 15.62,40.51
VREC  (via drill 0.3)
  Top 0.305: v109.47,37.34 v109.47,39.62
  Bottom 0.305: CAN_POWER.12 106.81,41.78 107.95,40.64 109.98,40.64 | 109.98,40.64 C16.P$1 | CAN_POWER.16 108.08,35.94 v109.47,37.34 | v109.47,39.62 109.47,40.13 109.98,40.64
XTAL1
  Bottom 0.305: R5.2 61.67,32.89 X1.1 65.03,32.9 C4.1 | C4.1 71.03,32.74 | U6.7 77.27,32.77 76.07,32.77 75.82,33.02 71.75,33.02 71.64,32.9 C4.1
XTAL2
  Bottom 0.305: R5.1 61.67,37.72 X1.2 66.79,35.95 C5.1 74.87,35.95 U6.8

### Text on the board
tPlace: C:/Users/Pyae Phyo Tun/Desktop/Auv/picture/label02.bmp
tNames: RST | SCK | GND | CANH | CANL | OUT | CAN_5V | CAN_GND | GND | IN | GND | 5V | RST | SCL | SDA | 5V | TXO | PE | RXI | 4V | 4V | PE | DTR
bNames: OUT | IN | 3 | 2